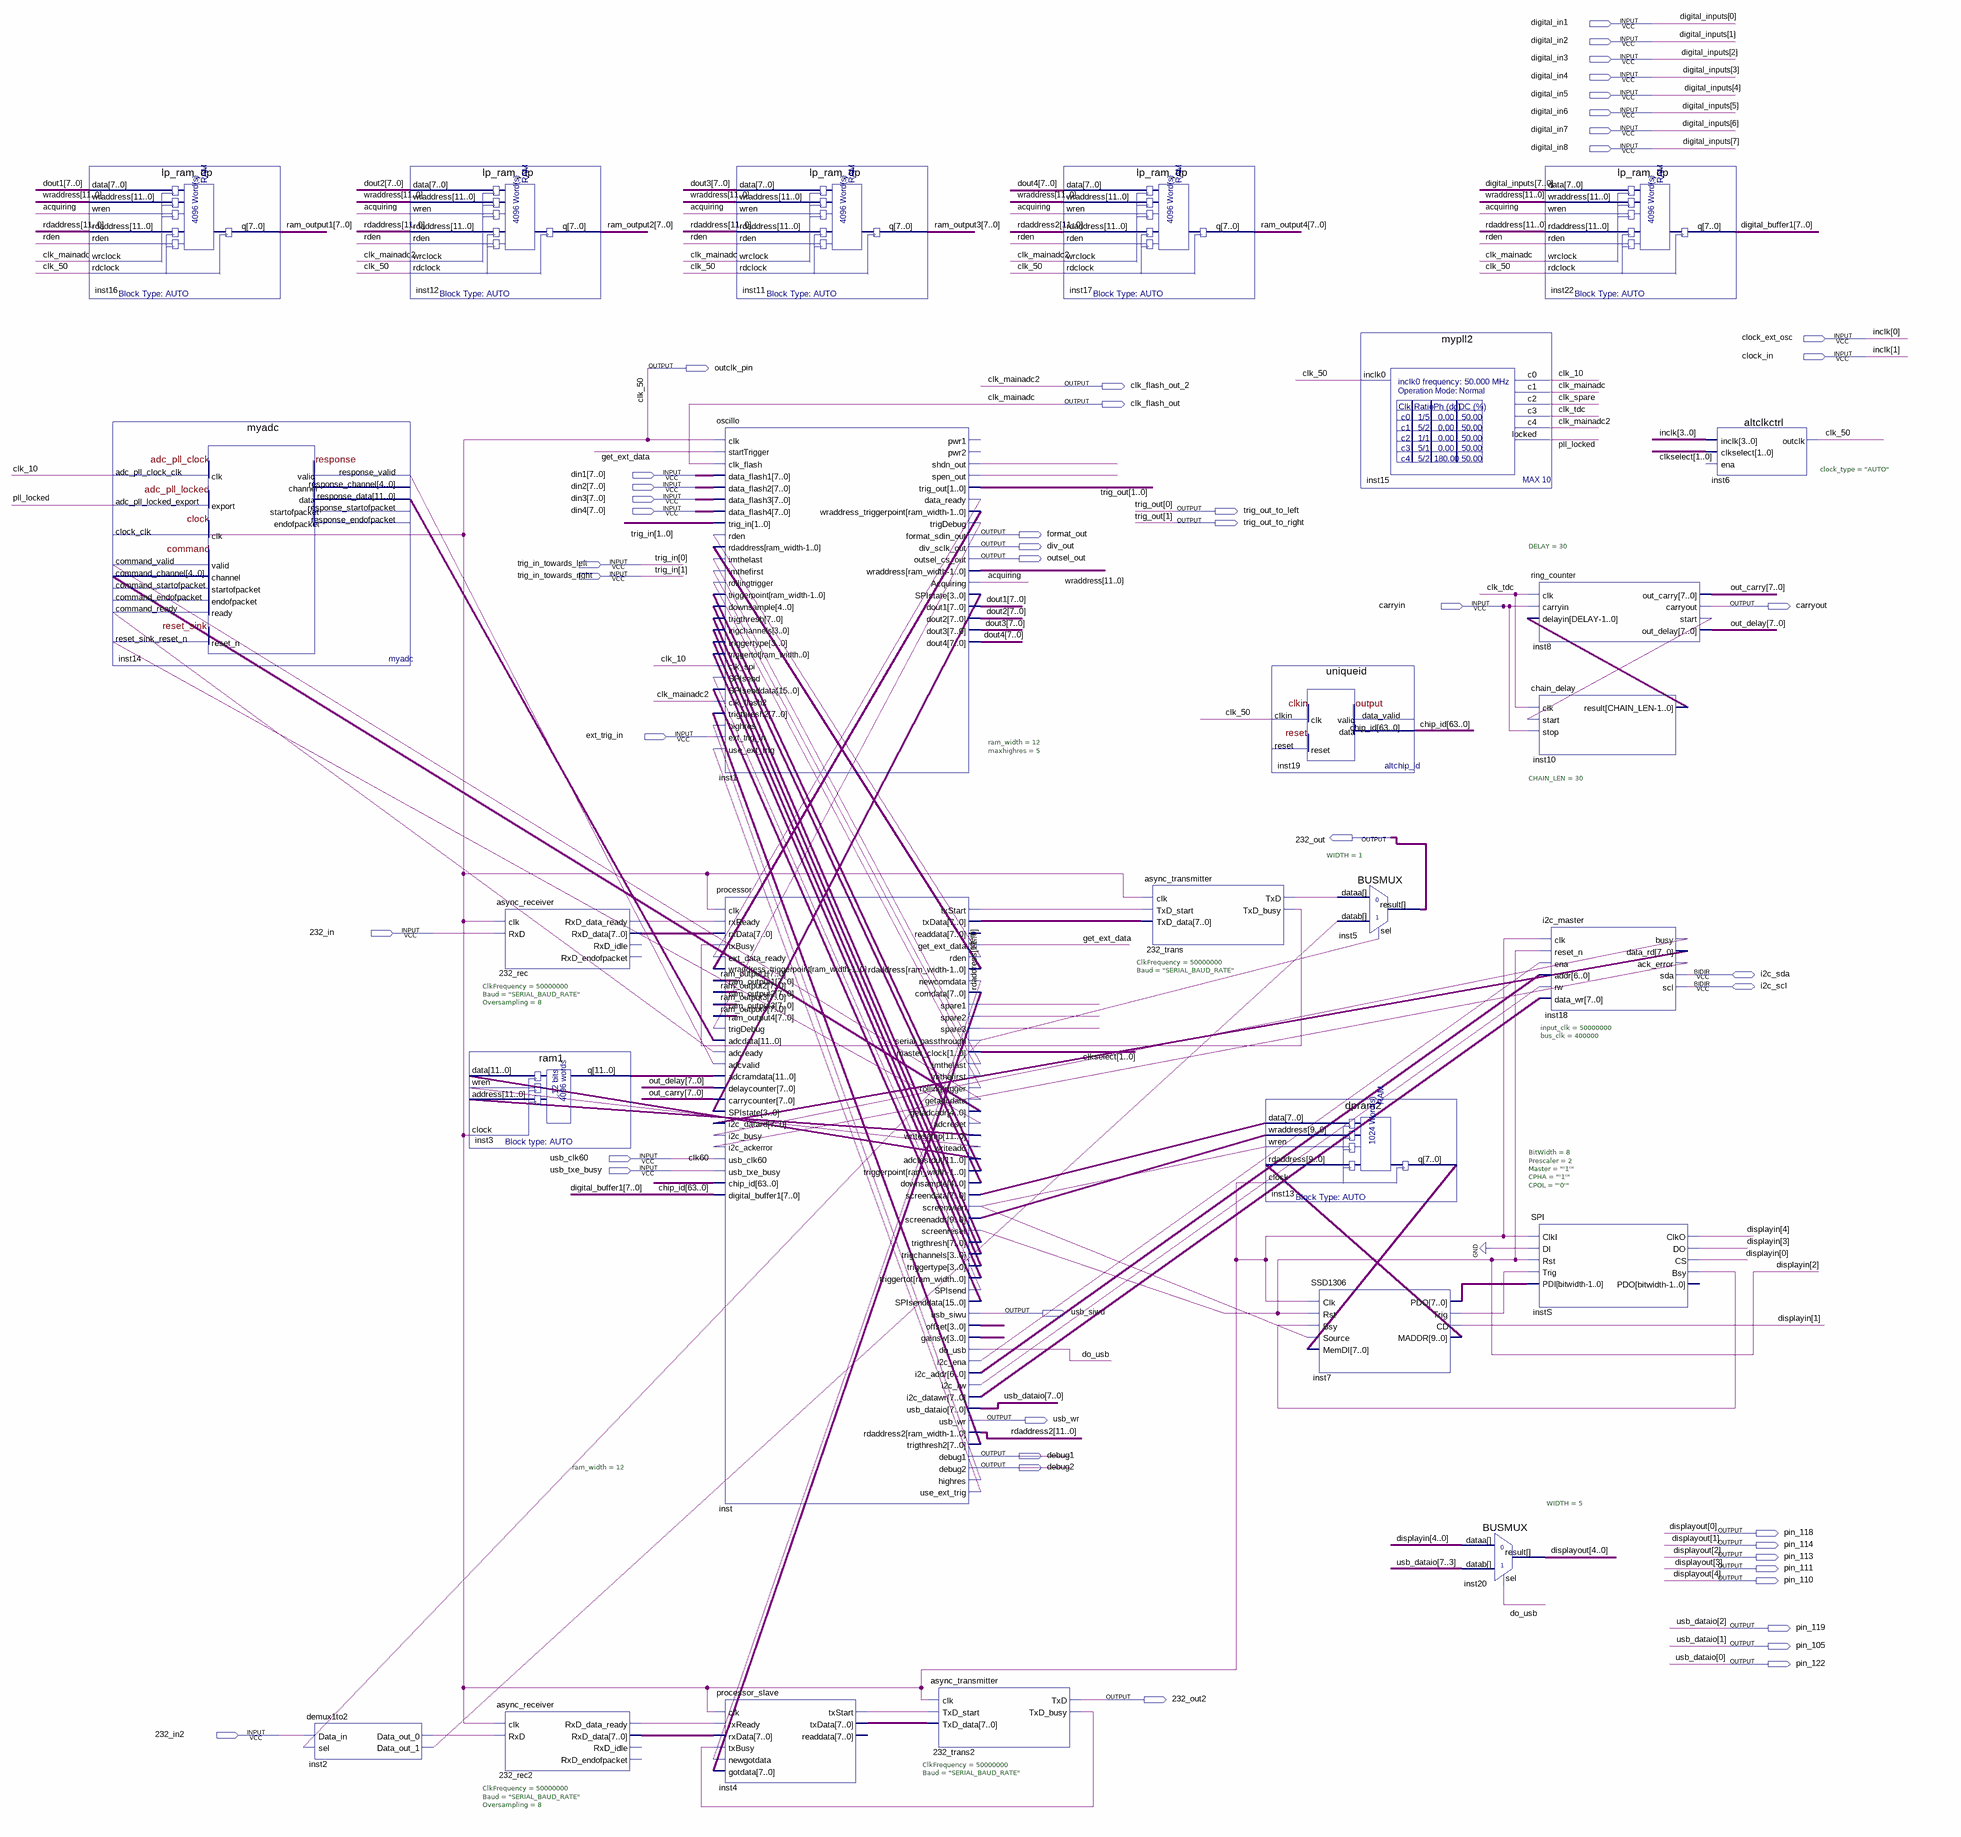
[diagram p0: schematic sheet]
// Quartus schematic serial1_v9.bdf as structural Verilog: 26 symbols, 47 pins
module serial1_v9 (
  input  digital_in1,
  input  digital_in2,
  input  digital_in3,
  input  digital_in4,
  input  digital_in5,
  input  digital_in6,
  input  digital_in7,
  input  digital_in8,
  input  clock_ext_osc,
  input  clock_in,
  input  [7:0] din1,
  input  [7:0] din2,
  input  [7:0] din3,
  input  [7:0] din4,
  input  trig_in_towards_left,
  input  trig_in_towards_right,
  input  carryin,
  input  ext_trig_in,
  input  \232_in ,
  input  usb_clk60,
  input  usb_txe_busy,
  input  \232_in2 ,
  inout  i2c_sda,
  inout  i2c_scl,
  output outclk_pin,
  output clk_flash_out_2,
  output clk_flash_out,
  output trig_out_to_left,
  output trig_out_to_right,
  output format_out,
  output div_out,
  output outsel_out,
  output carryout,
  output \232_out ,
  output usb_siwu,
  output usb_wr,
  output debug1,
  output debug2,
  output pin_118,
  output pin_114,
  output pin_113,
  output pin_111,
  output pin_110,
  output pin_119,
  output pin_105,
  output pin_122,
  output \232_out2 
);

  wire acquiring, clk_10, clk_spare, clk_tdc, do_usb, get_ext_data, inst1_data_ready, inst1_shdn_out,
       inst1_spen_out, inst1_trigdebug, inst2_data_out_0, inst2_data_out_1, inst4_txstart, inst7_trig,
       inst8_start, inst14_command_ready, inst14_response_valid, inst18_ack_error, inst18_busy,
       inst_adcreset, inst_getadcdata, inst_highres, inst_i2c_ena, inst_i2c_rw, inst_imthefirst,
       inst_imthelast, inst_newcomdata, inst_rollingtrigger, inst_screenwren, inst_serial_passthrough,
       inst_spare1, inst_spare2, inst_spare3, inst_spisend, inst_txstart, inst_use_ext_trig, inst_writeadc,
       instS_bsy, n232_rec2_rxd_data_ready, n232_rec_rxd_data_ready, n232_trans2_txd_busy, n232_trans_txd,
       n232_trans_txd_busy, pll_locked, rden;
  wire [1:0] clkselect;
  wire [3:0] inst1_spistate, inst_gainsw, inst_offset, inst_trigchannels, inst_triggertype;
  wire [3:2] inclk;
  wire [4:0] displayin, inst_downsample, inst_getadcadr;
  wire [6:0] inst_i2c_addr;
  wire [7:0] digital_buffer1, dout1, dout2, dout3, dout4, inst4_txdata, inst7_pdo, inst13_q, inst18_data_rd,
       inst_comdata, inst_i2c_datawr, inst_screendata, inst_trigthresh, inst_trigthresh2, inst_txdata,
       n232_rec2_rxd_data, n232_rec_rxd_data, out_carry, out_delay, ram_output1, ram_output2, ram_output3,
       ram_output4;
  wire [7:3] usb_dataio;
  wire [9:0] inst7_maddr, inst_screenaddr;
  wire [11:0] inst1_wraddress_triggerpoint, inst3_q, inst14_response_data, inst_adctestout,
       inst_triggerpoint, inst_writesamp, rdaddress, rdaddress2, wraddress;
  wire [12:0] inst_triggertot;
  wire [15:0] inst_spisenddata;
  wire [29:0] inst10_result;
  wire [63:0] chip_id;

  lp_ram_dp inst16 (
    .data(dout1), .wraddress(wraddress), .wren(acquiring), .rdaddress(rdaddress), .rden(rden),
    .wrclock(clk_flash_out), .rdclock(outclk_pin), .q(ram_output1));
  myadc inst14 (
    .adc_pll_clock_clk(clk_10), .adc_pll_locked_export(pll_locked), .clock_clk(outclk_pin),
    .command_valid(inst_getadcdata), .command_channel(inst_getadcadr), .reset_sink_reset_n(inst_adcreset),
    .command_ready(inst14_command_ready), .response_valid(inst14_response_valid),
    .response_data(inst14_response_data));  // open: command_startofpacket, command_endofpacket, response_channel, response_startofpacket, response_endofpacket
  demux1to2 inst2 (
    .Data_in(\232_in2 ), .sel(inst_serial_passthrough), .Data_out_0(inst2_data_out_0),
    .Data_out_1(inst2_data_out_1));
  lp_ram_dp inst12 (
    .data(dout2), .wraddress(wraddress), .wren(acquiring), .rdaddress(rdaddress), .rden(rden),
    .wrclock(clk_flash_out_2), .rdclock(outclk_pin), .q(ram_output2));
  async_receiver #(.ClkFrequency(50000000), .Baud("SERIAL_BAUD_RATE"), .Oversampling(8)) u_232_rec (
    .clk(outclk_pin), .RxD(\232_in ), .RxD_data_ready(n232_rec_rxd_data_ready), .RxD_data(n232_rec_rxd_data));  // open: RxD_idle, RxD_endofpacket
  ram1 inst3 (.data(inst_adctestout), .wren(inst_writeadc), .address(inst_writesamp), .clock(outclk_pin), .q(inst3_q));
  async_receiver #(.ClkFrequency(50000000), .Baud("SERIAL_BAUD_RATE"), .Oversampling(8)) u_232_rec2 (
    .clk(outclk_pin), .RxD(inst2_data_out_0), .RxD_data_ready(n232_rec2_rxd_data_ready),
    .RxD_data(n232_rec2_rxd_data));  // open: RxD_idle, RxD_endofpacket
  lp_ram_dp inst11 (
    .data(dout3), .wraddress(wraddress), .wren(acquiring), .rdaddress(rdaddress), .rden(rden),
    .wrclock(clk_flash_out), .rdclock(outclk_pin), .q(ram_output3));
  oscillo #(.ram_width(12), .maxhighres(5)) inst1 (
    .clk(outclk_pin), .startTrigger(get_ext_data), .clk_flash(clk_flash_out), .data_flash1(din1),
    .data_flash2(din2), .data_flash3(din3), .data_flash4(din4),
    .trig_in({trig_in_towards_right, trig_in_towards_left}), .rden(rden), .rdaddress(rdaddress),
    .imthelast(inst_imthelast), .imthefirst(inst_imthefirst), .rollingtrigger(inst_rollingtrigger),
    .triggerpoint(inst_triggerpoint), .downsample(inst_downsample), .trigthresh(inst_trigthresh),
    .trigchannels(inst_trigchannels), .triggertype(inst_triggertype), .triggertot(inst_triggertot),
    .clk_spi(clk_10), .SPIsend(inst_spisend), .SPIsenddata(inst_spisenddata), .clk_flash2(clk_flash_out_2),
    .trigthresh2(inst_trigthresh2), .highres(inst_highres), .ext_trig_in(ext_trig_in),
    .use_ext_trig(inst_use_ext_trig), .shdn_out(inst1_shdn_out), .spen_out(inst1_spen_out),
    .trig_out({trig_out_to_right, trig_out_to_left}), .data_ready(inst1_data_ready),
    .wraddress_triggerpoint(inst1_wraddress_triggerpoint), .trigDebug(inst1_trigdebug),
    .format_sdin_out(format_out), .div_sclk_out(div_out), .outsel_cs_out(outsel_out), .wraddress(wraddress),
    .Acquiring(acquiring), .SPIstate(inst1_spistate), .dout1(dout1), .dout2(dout2), .dout3(dout3),
    .dout4(dout4));  // open: pwr1, pwr2
  processor #(.ram_width(12)) inst (
    .clk(outclk_pin), .rxReady(n232_rec_rxd_data_ready), .rxData(n232_rec_rxd_data),
    .txBusy(n232_trans_txd_busy), .ext_data_ready(inst1_data_ready),
    .wraddress_triggerpoint(inst1_wraddress_triggerpoint), .ram_output1(ram_output1),
    .ram_output2(ram_output2), .ram_output3(ram_output3), .ram_output4(ram_output4),
    .trigDebug(inst1_trigdebug), .adcdata(inst14_response_data), .adcready(inst14_command_ready),
    .adcvalid(inst14_response_valid), .adcramdata(inst3_q), .delaycounter(out_delay),
    .carrycounter(out_carry), .SPIstate(inst1_spistate), .i2c_datard(inst18_data_rd), .i2c_busy(inst18_busy),
    .i2c_ackerror(inst18_ack_error), .usb_clk60(usb_clk60), .usb_txe_busy(usb_txe_busy), .chip_id(chip_id),
    .digital_buffer1(digital_buffer1), .txStart(inst_txstart), .txData(inst_txdata),
    .get_ext_data(get_ext_data), .rden(rden), .rdaddress(rdaddress), .newcomdata(inst_newcomdata),
    .comdata(inst_comdata), .spare1(inst_spare1), .spare2(inst_spare2), .spare3(inst_spare3),
    .serial_passthrough(inst_serial_passthrough), .master_clock(clkselect), .imthelast(inst_imthelast),
    .imthefirst(inst_imthefirst), .rollingtrigger(inst_rollingtrigger), .getadcdata(inst_getadcdata),
    .getadcadr(inst_getadcadr), .adcreset(inst_adcreset), .writesamp(inst_writesamp),
    .writeadc(inst_writeadc), .adctestout(inst_adctestout), .triggerpoint(inst_triggerpoint),
    .downsample(inst_downsample), .screendata(inst_screendata), .screenwren(inst_screenwren),
    .screenaddr(inst_screenaddr), .screenreset(displayin[2]), .trigthresh(inst_trigthresh),
    .trigchannels(inst_trigchannels), .triggertype(inst_triggertype), .triggertot(inst_triggertot),
    .SPIsend(inst_spisend), .SPIsenddata(inst_spisenddata), .usb_siwu(usb_siwu), .offset(inst_offset),
    .gainsw(inst_gainsw), .do_usb(do_usb), .i2c_ena(inst_i2c_ena), .i2c_addr(inst_i2c_addr),
    .i2c_rw(inst_i2c_rw), .i2c_datawr(inst_i2c_datawr), .usb_dataio({usb_dataio, pin_119, pin_105, pin_122}),
    .usb_wr(usb_wr), .rdaddress2(rdaddress2), .trigthresh2(inst_trigthresh2), .debug1(debug1),
    .debug2(debug2), .highres(inst_highres), .use_ext_trig(inst_use_ext_trig));  // open: readdata
  processor_slave inst4 (
    .clk(outclk_pin), .rxReady(n232_rec2_rxd_data_ready), .rxData(n232_rec2_rxd_data),
    .txBusy(n232_trans2_txd_busy), .newgotdata(inst_newcomdata), .gotdata(inst_comdata),
    .txStart(inst4_txstart), .txData(inst4_txdata));  // open: readdata
  async_transmitter #(.ClkFrequency(50000000), .Baud("SERIAL_BAUD_RATE")) u_232_trans2 (
    .clk(outclk_pin), .TxD_start(inst4_txstart), .TxD_data(inst4_txdata), .TxD(\232_out2 ),
    .TxD_busy(n232_trans2_txd_busy));
  lp_ram_dp inst17 (
    .data(dout4), .wraddress(wraddress), .wren(acquiring), .rdaddress(rdaddress2), .rden(rden),
    .wrclock(clk_flash_out_2), .rdclock(outclk_pin), .q(ram_output4));
  async_transmitter #(.ClkFrequency(50000000), .Baud("SERIAL_BAUD_RATE")) u_232_trans (
    .clk(outclk_pin), .TxD_start(inst_txstart), .TxD_data(inst_txdata), .TxD(n232_trans_txd),
    .TxD_busy(n232_trans_txd_busy));
  uniqueid inst19 (.clkin(outclk_pin), .chip_id(chip_id));  // open: reset, data_valid
  dpram2 inst13 (
    .data(inst_screendata), .wraddress(inst_screenaddr), .wren(inst_screenwren), .rdaddress(inst7_maddr),
    .clock(outclk_pin), .q(inst13_q));
  SSD1306 inst7 (
    .Clk(outclk_pin), .Rst(displayin[2]), .Bsy(instS_bsy), .Source(inst_screenwren), .MemDI(inst13_q),
    .PDO(inst7_pdo), .Trig(inst7_trig), .CD(displayin[1]), .MADDR(inst7_maddr));
  mypll2 inst15 (
    .inclk0(outclk_pin), .c0(clk_10), .c1(clk_flash_out), .c2(clk_spare), .c3(clk_tdc), .c4(clk_flash_out_2),
    .locked(pll_locked));
  BUSMUX #(.WIDTH(1)) inst5 (
    .datab(inst2_data_out_1), .sel(inst_serial_passthrough), .dataa(n232_trans_txd), .result(\232_out ));
  BUSMUX #(.WIDTH(5)) inst20 (
    .datab(usb_dataio), .sel(do_usb), .dataa(displayin),
    .result({pin_110, pin_111, pin_113, pin_114, pin_118}));
  lp_ram_dp inst22 (
    .data({digital_in8, digital_in7, digital_in6, digital_in5, digital_in4, digital_in3, digital_in2, digital_in1}),
    .wraddress(wraddress), .wren(acquiring), .rdaddress(rdaddress), .rden(rden), .wrclock(clk_flash_out),
    .rdclock(outclk_pin), .q(digital_buffer1));
  ring_counter #(.DELAY(30)) inst8 (
    .clk(clk_tdc), .carryin(carryin), .delayin(inst10_result), .out_carry(out_carry), .carryout(carryout),
    .start(inst8_start), .out_delay(out_delay));
  chain_delay #(.CHAIN_LEN(30)) inst10 (.clk(clk_tdc), .start(inst8_start), .stop(carryin), .result(inst10_result));
  i2c_master #(.input_clk(50000000), .bus_clk(400000)) inst18 (
    .clk(outclk_pin), .reset_n(displayin[2]), .ena(inst_i2c_ena), .addr(inst_i2c_addr), .rw(inst_i2c_rw),
    .data_wr(inst_i2c_datawr), .busy(inst18_busy), .data_rd(inst18_data_rd), .ack_error(inst18_ack_error),
    .sda(i2c_sda), .scl(i2c_scl));
  SPI #(.BitWidth(8), .Prescaler(2), .Master("'1'"), .CPHA("'1'"), .CPOL("'0'")) instS (
    .ClkI(outclk_pin), .DI(1'b0), .Rst(displayin[2]), .Trig(inst7_trig), .PDI(inst7_pdo),
    .ClkO(displayin[4]), .DO(displayin[3]), .CS(displayin[0]), .Bsy(instS_bsy));  // open: PDO
  altclkctrl #(.clock_type("AUTO")) inst6 (
    .inclk({inclk, clock_in, clock_ext_osc}), .clkselect(clkselect), .outclk(outclk_pin));  // open: ena

  // Other names for the same wires on the sheet: clk60 = usb_clk60; clk_50 = outclk_pin; clk_mainadc = clk_flash_out;
  //   clk_mainadc2 = clk_flash_out_2;
  //   digital_inputs[7:0] = {digital_in8, digital_in7, digital_in6, digital_in5, digital_in4, digital_in3, digital_in2, digital_in1};
  //   displayout[4:0] = {pin_110, pin_111, pin_113, pin_114, pin_118}; inclk[1:0] = {clock_in, clock_ext_osc};
  //   trig_in[1:0] = {trig_in_towards_right, trig_in_towards_left};
  //   trig_out[1:0] = {trig_out_to_right, trig_out_to_left}; usb_dataio[2:0] = {pin_119, pin_105, pin_122}
endmodule
